# Altium schematic sheet NB3000_AVI_Player.SchDoc
size B
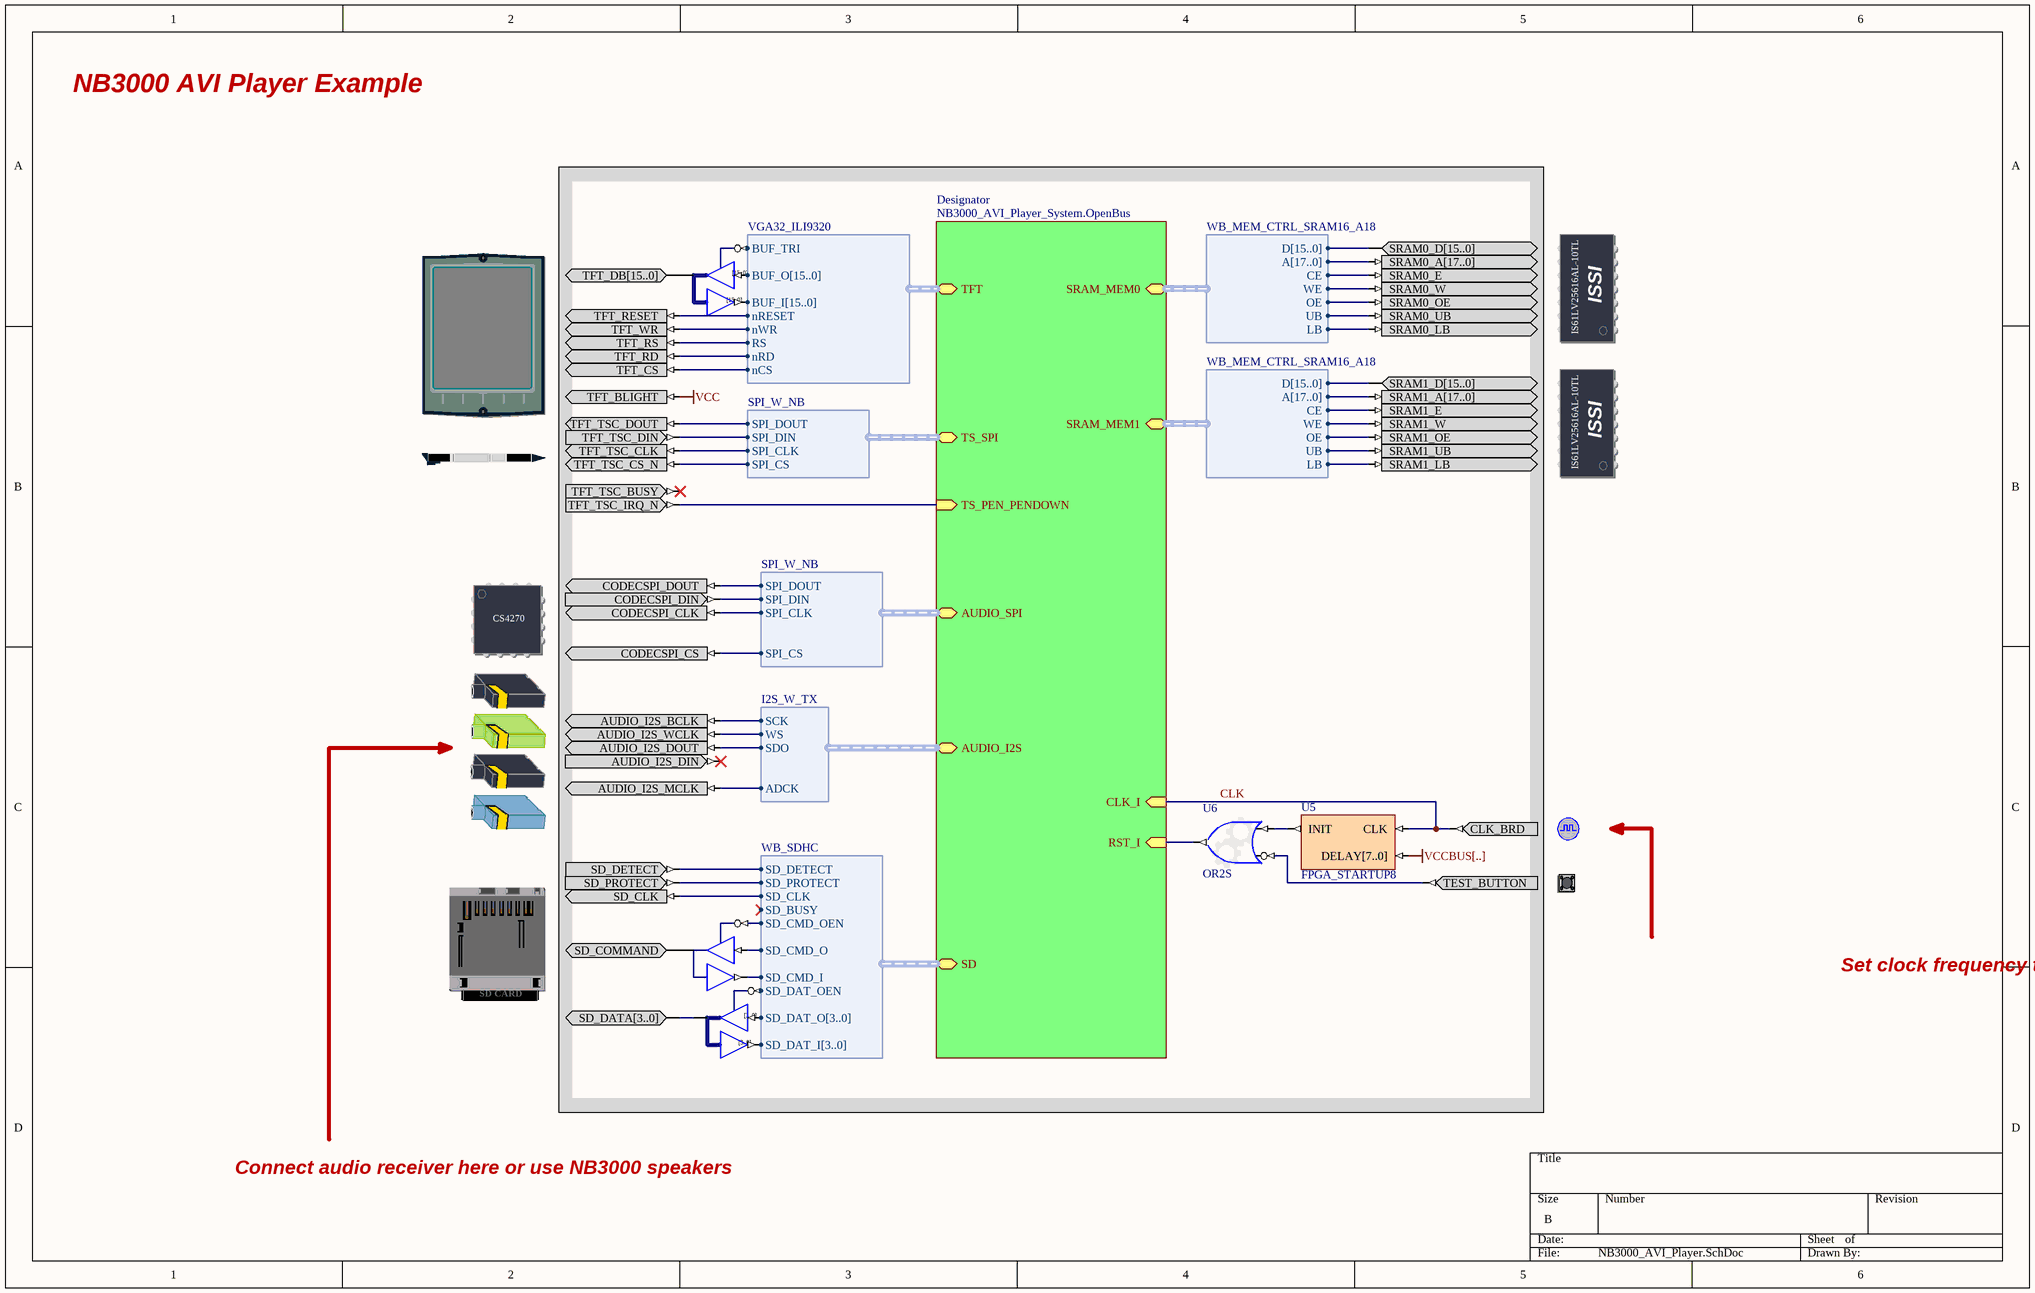
[diagram p0: NB3000_AVI_Player.SchDoc]

## Parts
(Parts that share a designator on the sheet are numbered #1, #2 ... from top to bottom, then left to right.)
?#1  SRAM0  (value not drawn)
?#2  TFT_LCD  (value not drawn)
?#3  SRAM1  (value not drawn)
?#4  TOUCH_SCREEN_PEN  (value not drawn)
?#5  AUDIO_CODEC_CTRL  (value not drawn)
?#6  AUDIO_CODEC  (value not drawn)
?#7  CLOCK_BOARD  (value not drawn)
?#8  SD_HOST  (value not drawn)
?#9  TEST_BUTTON  (value not drawn)
IOBUF_CMD  IOBUF  (value not drawn)
IOBUF_DATA  IOBUF4B  (value not drawn)
U5  FPGA_STARTUP8
U6  OR2S
UIBUF_TFT  IOBUF16B  (value not drawn)

## Sub-sheets
Designator = NB3000_AVI_Player_System.OpenBus: CLK_I (in), RST_I (in), SRAM_MEM0 (harness WB_MEM_CTRL_SRAM16_A18), SRAM_MEM1 (harness WB_MEM_CTRL_SRAM16_A18), TFT (harness VGA32_ILI9320), AUDIO_SPI (harness SPI_W_NB), TS_SPI (harness SPI_W_NB), TS_PEN_PENDOWN (in), AUDIO_I2S (harness I2S_W_TX), SD (harness WB_SDHC)

## Harnesses
WB_MEM_CTRL_SRAM16_A18: D[15..0], A[17..0], CE, WE, OE, UB, LB
SPI_W_NB: SPI_DOUT, SPI_DIN, SPI_CLK, SPI_CS
VGA32_ILI9320: BUF_TRI, BUF_O[15..0], BUF_I[15..0], nRESET, nWR, RS, nRD, nCS
I2S_W_TX: SCK, WS, SDO, ADCK
WB_SDHC: SD_DETECT, SD_PROTECT, SD_CLK, SD_BUSY, SD_CMD_OEN, SD_CMD_O, SD_CMD_I, SD_DAT_OEN, SD_DAT_O[3..0], SD_DAT_I[3..0]

## Nets
VCC: ?#2.TFT_BLIGHT
VCCBUS[..]: U5.DELAY[7..0]
CLK: ?#7.CLK_BRD U5.CLK ; sheet Designator/CLK_I
Net?#1_SRAM0_A[17..0]: ?#1.SRAM0_A[17..0] ; sheet Designator/SRAM_MEM0.A[17..0]
Net?#1_SRAM0_D[15..0]: ?#1.SRAM0_D[15..0] ; sheet Designator/SRAM_MEM0.D[15..0]
Net?#1_SRAM0_E: ?#1.SRAM0_E ; sheet Designator/SRAM_MEM0.CE
Net?#1_SRAM0_LB: ?#1.SRAM0_LB ; sheet Designator/SRAM_MEM0.LB
Net?#1_SRAM0_OE: ?#1.SRAM0_OE ; sheet Designator/SRAM_MEM0.OE
Net?#1_SRAM0_UB: ?#1.SRAM0_UB ; sheet Designator/SRAM_MEM0.UB
Net?#1_SRAM0_W: ?#1.SRAM0_W ; sheet Designator/SRAM_MEM0.WE
Net?#2_TFT_CS: ?#2.TFT_CS ; sheet Designator/TFT.nCS
Net?#2_TFT_DB[15..0]: ?#2.TFT_DB[15..0] UIBUF_TFT.IO[15..0]
Net?#2_TFT_RD: ?#2.TFT_RD ; sheet Designator/TFT.nRD
Net?#2_TFT_RESET: ?#2.TFT_RESET ; sheet Designator/TFT.nRESET
Net?#2_TFT_RS: ?#2.TFT_RS ; sheet Designator/TFT.RS
Net?#2_TFT_WR: ?#2.TFT_WR ; sheet Designator/TFT.nWR
Net?#3_SRAM1_A[17..0]: ?#3.SRAM1_A[17..0] ; sheet Designator/SRAM_MEM1.A[17..0]
Net?#3_SRAM1_D[15..0]: ?#3.SRAM1_D[15..0] ; sheet Designator/SRAM_MEM1.D[15..0]
Net?#3_SRAM1_E: ?#3.SRAM1_E ; sheet Designator/SRAM_MEM1.CE
Net?#3_SRAM1_LB: ?#3.SRAM1_LB ; sheet Designator/SRAM_MEM1.LB
Net?#3_SRAM1_OE: ?#3.SRAM1_OE ; sheet Designator/SRAM_MEM1.OE
Net?#3_SRAM1_UB: ?#3.SRAM1_UB ; sheet Designator/SRAM_MEM1.UB
Net?#3_SRAM1_W: ?#3.SRAM1_W ; sheet Designator/SRAM_MEM1.WE
Net?#4_TFT_TSC_CLK: ?#4.TFT_TSC_CLK ; sheet Designator/TS_SPI.SPI_CLK
Net?#4_TFT_TSC_CS_N: ?#4.TFT_TSC_CS_N ; sheet Designator/TS_SPI.SPI_CS
Net?#4_TFT_TSC_DIN: ?#4.TFT_TSC_DIN ; sheet Designator/TS_SPI.SPI_DIN
Net?#4_TFT_TSC_DOUT: ?#4.TFT_TSC_DOUT ; sheet Designator/TS_SPI.SPI_DOUT
Net?#4_TFT_TSC_IRQ_N: ?#4.TFT_TSC_IRQ_N ; sheet Designator/TS_PEN_PENDOWN
Net?#5_CODECSPI_CLK: ?#5.CODECSPI_CLK ; sheet Designator/AUDIO_SPI.SPI_CLK
Net?#5_CODECSPI_CS: ?#5.CODECSPI_CS ; sheet Designator/AUDIO_SPI.SPI_CS
Net?#5_CODECSPI_DIN: ?#5.CODECSPI_DIN ; sheet Designator/AUDIO_SPI.SPI_DIN
Net?#5_CODECSPI_DOUT: ?#5.CODECSPI_DOUT ; sheet Designator/AUDIO_SPI.SPI_DOUT
Net?#6_AUDIO_I2S_BCLK: ?#6.AUDIO_I2S_BCLK ; sheet Designator/AUDIO_I2S.SCK
Net?#6_AUDIO_I2S_DOUT: ?#6.AUDIO_I2S_DOUT ; sheet Designator/AUDIO_I2S.SDO
Net?#6_AUDIO_I2S_MCLK: ?#6.AUDIO_I2S_MCLK ; sheet Designator/AUDIO_I2S.ADCK
Net?#6_AUDIO_I2S_WCLK: ?#6.AUDIO_I2S_WCLK ; sheet Designator/AUDIO_I2S.WS
Net?#8_SD_CLK: ?#8.SD_CLK ; sheet Designator/SD.SD_CLK
Net?#8_SD_COMMAND: ?#8.SD_COMMAND IOBUF_CMD.IO
Net?#8_SD_DATA[3..0]: ?#8.SD_DATA[3..0] IOBUF_DATA.IO[3..0]
Net?#8_SD_DETECT: ?#8.SD_DETECT ; sheet Designator/SD.SD_DETECT
Net?#8_SD_PROTECT: ?#8.SD_PROTECT ; sheet Designator/SD.SD_PROTECT
Net?#9_TEST_BUTTON: ?#9.TEST_BUTTON U6.I1
NetIOBUF_CMD_I: IOBUF_CMD.I ; sheet Designator/SD.SD_CMD_O
NetIOBUF_CMD_O: IOBUF_CMD.O ; sheet Designator/SD.SD_CMD_I
NetIOBUF_CMD_T: IOBUF_CMD.T ; sheet Designator/SD.SD_CMD_OEN
NetIOBUF_DATA_I[3..0]: IOBUF_DATA.I[3..0] ; sheet Designator/SD.SD_DAT_O[3..0]
NetIOBUF_DATA_O[3..0]: IOBUF_DATA.O[3..0] ; sheet Designator/SD.SD_DAT_I[3..0]
NetIOBUF_DATA_T: IOBUF_DATA.T ; sheet Designator/SD.SD_DAT_OEN
NetU5_INIT: U5.INIT U6.I0
NetU6_O: U6.O ; sheet Designator/RST_I
NetUIBUF_TFT_I[15..0]: UIBUF_TFT.I[15..0] ; sheet Designator/TFT.BUF_O[15..0]
NetUIBUF_TFT_O[15..0]: UIBUF_TFT.O[15..0] ; sheet Designator/TFT.BUF_I[15..0]
NetUIBUF_TFT_T: UIBUF_TFT.T ; sheet Designator/TFT.BUF_TRI

Not connected (* = marked no-connect by the designer): ?#4 TFT_TSC_BUSY*; ?#6 AUDIO_I2S_DIN*

## Notes on the sheet
- NB3000 AVI Player Example
- Set clock frequency to 50 MHz
- Connect audio receiver here or use NB3000 speakers
- (in symbol AUDIO_CODEC_CTRL) CS4270
- (in symbol IOBUF4B) [3..0]
- (in symbol IOBUF16B) [15..0]
- (in symbol SD_HOST) SD CARD
- (in symbol SRAM0) ISSI; IS61LV25616AL-10TL
- (in symbol SRAM1) ISSI; IS61LV25616AL-10TL

## Library data of the parts
?#1 = SRAM0: Free Static RAM - Daughterboard; PortComponent: True; Published: 14-May-2007; Publisher: Altium Limited; HelpURL: https://wiki.altium.com/display/ADOH/NanoBoard+3000+-+Independent+SRAM
?#2 = TFT_LCD: TFT LCD Panel; PortComponent: True; Published: 22-Jan-2007; Publisher: Altium Limited; HelpURL: https://wiki.altium.com/display/ADOH/NanoBoard+3000+-+TFT+LCD+Panel+%28with+Touch+Screen%29
?#3 = SRAM1: Free Static RAM - Daughterboard; PortComponent: True; Published: 14-May-2007; Publisher: Altium Limited; HelpURL: https://wiki.altium.com/display/ADOH/NanoBoard+3000+-+Independent+SRAM
?#4 = TFT_PEN: Touch Screen Pen Control; PortComponent: True; Published: 22-Jan-2007; Publisher: Altium Limited; HelpURL: https://wiki.altium.com/display/ADOH/NanoBoard+3000+-+TFT+LCD+Panel+%28with+Touch+Screen%29
?#5 = AUDIO_CODEC_CTRL: Audio Codec Control; PortComponent: True; Published: 22-Jan-2007; Publisher: Altium Limited; HelpURL: https://wiki.altium.com/display/ADOH/NanoBoard+3000+-+Audio+CODEC
?#6 = AUDIO_CODEC: Audio Codec; PortComponent: True; IncludeInDSF: AUDIO_CS4270; Published: 22-Jan-2007; Publisher: Altium Limited; HelpURL: https://wiki.altium.com/display/ADOH/NanoBoard+3000+-+Audio+CODEC
?#7 = CLOCK_BOARD: Global System Clock Supply; PortComponent: True; Published: 19-Nov-2003; Publisher: Altium Limited; HelpURL: TR0143 Technical Reference Manual for Altium's Desktop NanoBoard NB2DSK01.pdf#page=41; UseInDSF: True
?#8 = SD_HOST: Secure Digital Card Host; PortComponent: True; Published: 30-Nov-2009; Publisher: Altium Limited; UseInDSF: True
?#9 = TEST_BUTTON: Test / Reset Button; PortComponent: True; Published: 19-Nov-2003; Publisher: Altium Limited; HelpURL: TR0143 Technical Reference Manual for Altium's Desktop NanoBoard NB2DSK01.pdf#page=53
IOBUF_CMD = IOBUF: Input/Output Buffer; Enable: Low; Control: Common Control T; ArchiveName: GENERIC; VHDLIB_SIM: GENERIC_LIB; Published: 29-Jan-2004; Publisher: Altium Limited; XilinxEquivalent: IOBUF; LastRevisionNo: 1.00.00; HelpURL: CR0118 FPGA Generic Library Guide.pdf#page=293; ComponentLink1URL: CR0125 FPGA Buffer Resource Usage.pdf#page=78; ComponentLink1Description: Core &Resource Usage; FunctionalClass: Buffer; SubClass: IOBUF
IOBUF_DATA = IOBUF4B: 4-Bit Input/Output Buffer, Bus Version; SubClass: IOBUF; Enable: Low; Control: Common Control T; PortSize: 4; ArchiveName: GENERIC; VHDLIB_SIM: GENERIC_LIB; Published: 29-Jan-2004; Publisher: Altium Limited; LastRevisionNo: 1.00.00; HelpURL: CR0118 FPGA Generic Library Guide.pdf#page=293; ComponentLink1URL: CR0125 FPGA Buffer Resource Usage.pdf#page=82; ComponentLink1Description: Core &Resource Usage; FunctionalClass: Buffer; PortStyle: Bus Version
U5 = FPGA_STARTUP8: FPGA Startup With 8 Bit Delay; Published: 9-Dec-2004; Publisher: Altium Limited; HelpURL: CR0119 FPGA_STARTUPx Powerup Delay Unit.pdf; LastRevisionNo: 1.00.00; ComponentLink1Description: Core &Resource Usage; ComponentLink1URL: CR0139 FPGA Peripheral Resource Usage.pdf#page=11
U6 = GATE: Configurable Generic Gate; ConfiguratorName: GENERIC_GATE; ConfigurationParameters: {}Version[1.0]{}GateKind[OR]{}BusInput[False]{}GateInputType[Bit]{}GateOutputOption[Normal]{}BusWidth[8]{}RegisterOutputs[False]{}NegativeClockEdge[False]{}InputCount[2]{}InputInvert0[False]{}InputInvert1[True]{}; LastRevisionNo: 1.00.00; Published: 3-Sep-2008; Publisher: Altium Limited
UIBUF_TFT = IOBUF16B: 16-Bit Input/Output Buffer, Bus Version; SubClass: IOBUF; Enable: Low; Control: Common Control T; PortSize: 16; ArchiveName: GENERIC; VHDLIB_SIM: GENERIC_LIB; Published: 29-Jan-2004; Publisher: Altium Limited; LastRevisionNo: 1.00.00; HelpURL: CR0118 FPGA Generic Library Guide.pdf#page=293; ComponentLink1URL: CR0125 FPGA Buffer Resource Usage.pdf#page=91; ComponentLink1Description: Core &Resource Usage; FunctionalClass: Buffer; PortStyle: Bus Version